# Altium schematic sheet Protection_Stage.SchDoc: PDM
size A3; SheetNumber: 6; SheetTotal: 6
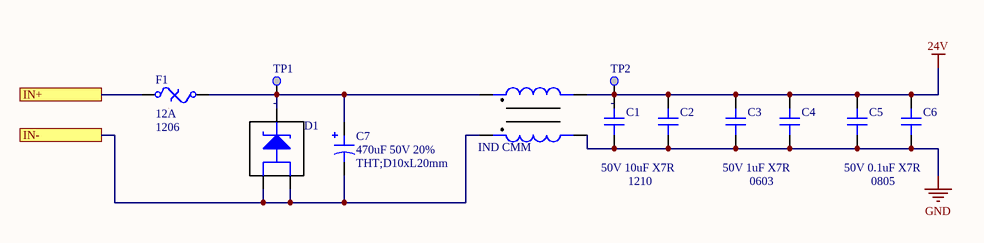
[diagram p0: Protection_Stage.SchDoc]

## Parts
C1  value 50V 10uF X7R  Package: 1210  [CAP SMD 1210]  (hidden comment: CAP non polarized)
C2  CAP non polarized  [CAP SMD 1210]  (value not drawn)
C3  value 50V 1uF X7R  Package: 0603  [CAP SMD 0603]  (hidden comment: CAP non polarized)
C4  CAP non polarized  [CAP SMD 0603]  (value not drawn)
C5  value 50V 0.1uF X7R  Package: 0805  [CAP SMD 0805]  (hidden comment: CAP non polarized)
C6  CAP non polarized  [CAP SMD 0805]  (value not drawn)
C7  value 470uF 50V 20%  Package: THT;D10xL20mm  [CAP_10Dx20L]  (hidden comment: CAP polarized)
D1  DIODE SCHOTTKY 3P  [TO-277A-3]  (value not drawn)
F1  value 12A  Package: 1206  [FUSE SMD 1206]  (hidden comment: FUSE)
L1  IND CMM  [IND_CMM_THT_10x18.5mm]
TP1  Test Point  [TP_SMD_1MM]  (value not drawn)  (no BOM)
TP2  Test Point  [TP_SMD_1MM]  (value not drawn)  (no BOM)

## Ports
IN+, IN-

## Nets
24V: C1.1 C2.1 C3.1 C4.1 C5.1 C6.1 L1.2 TP2.1
GND: C1.2 C2.2 C3.2 C4.2 C5.2 C6.2 L1.3
IN+: F1.1 ; port IN+
IN-: C7.N D1.1 D1.2 L1.4 ; port IN-
NetC7_P: C7.P D1.3 F1.2 L1.1 TP1.1

## Notes on the sheet
- Project:
- Subsystem:
- Company:
- Document:
- Author:
- Revision:
- Date:
- Sheet:
- /

## Library data of the parts
C1 = 001-0104: Condensadores de cerámica multicapa (MLCC- SMD/SMT) WCAP-CSGP 10uF 50Vol 0.1; MPN: 885012209073; Manufacturer: Wurth Elektronik; ComponentLink1Description: Datasheet; ComponentLink1URL: https://www.we-online.com/components/products/datasheet/885012209073.pdf; ComponentLink2Description: Distributor Link; ComponentLink2URL: https://www.mouser.es/ProductDetail/Wurth-Elektronik/885012209073?qs=sPbYRqrBIVm8PsM2ljQIMg%3D%3D; ID: 001-0104; Distributor PN: 710-885012209073; Distributor: Mouser
C2 = 001-0104: Condensadores de cerámica multicapa (MLCC- SMD/SMT) WCAP-CSGP 10uF 50Vol 0.1; MPN: 885012209073; Manufacturer: Wurth Elektronik; Value: 50V 10uF X7R; ComponentLink1Description: Datasheet; ComponentLink1URL: https://www.we-online.com/components/products/datasheet/885012209073.pdf; ComponentLink2Description: Distributor Link; ComponentLink2URL: https://www.mouser.es/ProductDetail/Wurth-Elektronik/885012209073?qs=sPbYRqrBIVm8PsM2ljQIMg%3D%3D; Package: 1210; ID: 001-0104; Distributor PN: 710-885012209073; Distributor: Mouser
C3 = 001-0102: Condensadores de cerámica multicapa (MLCC- SMD/SMT) WCAP-CSGP 1uF 50 Vol 10%; MPN: 885012206126; Manufacturer: Wurth Elektronik; ComponentLink1Description: Datasheet; ComponentLink1URL: https://www.we-online.com/components/products/datasheet/885012206126.pdf; ComponentLink2Description: Distributor Link; ComponentLink2URL: https://www.mouser.es/ProductDetail/Wurth-Elektronik/885012206126?qs=amGC7iS6iy%2F%252BJOLb%2FSuwig%3D%3D; ID: 001-0102; Distributor PN: 710-885012206126; Distributor: Mouser
C4 = 001-0102: Condensadores de cerámica multicapa (MLCC- SMD/SMT) WCAP-CSGP 1uF 50 Vol 10%; MPN: 885012206126; Manufacturer: Wurth Elektronik; Value: 50V 1uF X7R; ComponentLink1Description: Datasheet; ComponentLink1URL: https://www.we-online.com/components/products/datasheet/885012206126.pdf; ComponentLink2Description: Distributor Link; ComponentLink2URL: https://www.mouser.es/ProductDetail/Wurth-Elektronik/885012206126?qs=amGC7iS6iy%2F%252BJOLb%2FSuwig%3D%3D; Package: 0603; ID: 001-0102; Distributor PN: 710-885012206126; Distributor: Mouser
C5 = 001-0100: Condensadores de cerámica multicapa (MLCC- SMD/SMT) WCAP-CSGP 0.1uF 0805 10% 50V MLCC; MPN: 885012207098; Manufacturer: Wurth Elektronik; ComponentLink1Description: Datasheet; ComponentLink1URL: https://www.we-online.com/components/products/datasheet/885012207098.pdf; ComponentLink2Description: Distributor Link; ComponentLink2URL: https://www.mouser.es/ProductDetail/Wurth-Elektronik/885012207098?qs=0KOYDY2FL29sZCNyRsrK9g%3D%3D; ID: 001-0100; Distributor PN: 710-885012207098; Distributor: Mouser
C6 = 001-0100: Condensadores de cerámica multicapa (MLCC- SMD/SMT) WCAP-CSGP 0.1uF 0805 10% 50V MLCC; MPN: 885012207098; Manufacturer: Wurth Elektronik; Value: 50V 0.1uF X7R; ComponentLink1Description: Datasheet; ComponentLink1URL: https://www.we-online.com/components/products/datasheet/885012207098.pdf; ComponentLink2Description: Distributor Link; ComponentLink2URL: https://www.mouser.es/ProductDetail/Wurth-Elektronik/885012207098?qs=0KOYDY2FL29sZCNyRsrK9g%3D%3D; Package: 0805; ID: 001-0100; Distributor PN: 710-885012207098; Distributor: Mouser
C7 = 003-0001: Aluminium Electrolytic Capacitors - Radial Leaded WCAP-ATG5 470uF 50V 20% Radial; MPN: 860020675022; Manufacturer: Wurth Elektonik; ComponentLink1Description: Datasheet; ComponentLink2Description: Distributor Link; ID: 003-0001; Distributor PN: 710-860020675022; Distributor: Mouser; Datasheet: https://www.we-online.com/components/products/datasheet/860020675022.pdf; Distributor Link: https://www.mouser.es/ProductDetail/Wurth-Elektronik/860020675022?qs=0KOYDY2FL28clmrWTWQzzg%3D%3D
D1 = 031-0012: Diodos y rectificadores Schottky 20A,100VG2PSKYSMPCRect.; MPN: SS20PH102HM3/I; Manufacturer: Vishay Semiconductors; Value: 100V 20A; ComponentLink1Description: Datasheet; ComponentLink1URL: https://www.mouser.es/ProductDetail/Vishay-Semiconductors/SS20PH102HM3-I?qs=G4MbTVxgV4H1JubFDv9ZpA%3D%3D; ComponentLink2Description: Distributor Link; ComponentLink2URL: https://www.vishay.com/docs/98847/ss20ph102.pdf; ID: 031-0012; Package: TO-277A-2; Distributor PN: 78-SS20PH102HM3/I; Distributor: Mouser
F1 = 040-0026: Surface Mount Fuses 12A 32V FAST ACTING; MPN: 0501012.WRA; Manufacturer: Littelfuse; ComponentLink1Description: Datasheet; ComponentLink1URL: https://www.littelfuse.com/assetdocs/littelfuse_fuse_501a_datasheet.pdf?assetguid=16e534f2-c7ad-421d-9fb1-2d7646704d65; ComponentLink2Description: Distributor Link; ComponentLink2URL: https://www.mouser.es/en/ProductDetail/Littelfuse/0501012.WRA?qs=r5DSvlrkXmL6WmckR9m8eg%3D%3D; ID: 040-0026; Distributor PN: 576-0501012.WRA; Distributor: Mouser
L1 = 023-0001: Common Mode Chokes / Filters WE-CMB Type XXL .5mH 35A 2.3mOhm; MPN: 7448263505; Manufacturer: Wurth Elektronik; Value: 0.5mH 35A 2.3mOhm; ComponentLink1Description: Datasheet; ComponentLink1URL: *; ComponentLink2Description: Distributor Link; ComponentLink2URL: *; ID: 023-0001; Package: 47x43x23.5mm; Distributor PN: 710-7448263505; Distributor: Mouser; Datasheet: https://www.we-online.com/components/products/datasheet/7448263505.pdf; Distributor Link: https://www.mouser.es/ProductDetail/Wurth-Elektronik/7448263505?qs=2kOmHSv6VfR2wo62vNWXfg%3D%3D
TP1 TP2 = 110-0007: ComponentLink1URL: -; ComponentLink1Description: Datasheet; ComponentLink1URL: *; ComponentLink2Description: Distributor Link; ComponentLink2URL: -; ID: 110-0007; Value: -; Package: -; MPN: -; Manufacturer: -; Distributor PN: -; Distributor: -